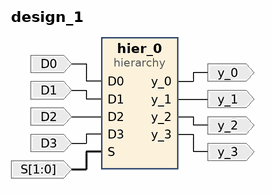
[diagram p0: block diagram of the top level]
# Vivado block design design_1, xc7z010clg400-1, Vivado 2023.2.2
create_bd_design design_1

create_bd_port -dir O y_0
create_bd_port -dir O y_1
create_bd_port -dir O y_2
create_bd_port -dir O y_3
create_bd_port -dir I -type data D0
create_bd_port -dir I D1
create_bd_port -dir I D2
create_bd_port -dir I D3
create_bd_port -dir I -from 1 -to 0 S

create_bd_cell -type hier hier_0

# ---- hierarchy /hier_0 ----
current_bd_instance /hier_0
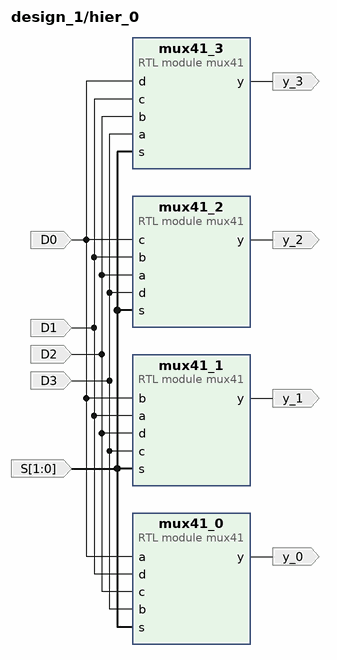
[diagram p1: block diagram inside /hier_0]
create_bd_pin -dir I -type data D0
create_bd_pin -dir I D3
create_bd_pin -dir I D2
create_bd_pin -dir I D1
create_bd_pin -dir I -from 1 -to 0 S
create_bd_pin -dir O y_0
create_bd_pin -dir O y_1
create_bd_pin -dir O y_2
create_bd_pin -dir O y_3

create_bd_cell -type module -reference mux41 mux41_0
create_bd_cell -type module -reference mux41 mux41_1
create_bd_cell -type module -reference mux41 mux41_2
create_bd_cell -type module -reference mux41 mux41_3

# ---- connections ----

current_bd_instance /hier_0
connect_bd_net -net D0_1 [get_bd_pins D0] [get_bd_pins mux41_3/d] [get_bd_pins mux41_1/b] [get_bd_pins mux41_2/c] [get_bd_pins mux41_0/a]
connect_bd_net -net D1_1 [get_bd_pins D1] [get_bd_pins mux41_3/c] [get_bd_pins mux41_2/b] [get_bd_pins mux41_1/a] [get_bd_pins mux41_0/d]
connect_bd_net -net D2_1 [get_bd_pins D2] [get_bd_pins mux41_3/b] [get_bd_pins mux41_2/a] [get_bd_pins mux41_1/d] [get_bd_pins mux41_0/c]
connect_bd_net -net D3_1 [get_bd_pins D3] [get_bd_pins mux41_3/a] [get_bd_pins mux41_1/c] [get_bd_pins mux41_2/d] [get_bd_pins mux41_0/b]
connect_bd_net [get_bd_pins S] [get_bd_pins mux41_3/s] [get_bd_pins mux41_2/s] [get_bd_pins mux41_1/s] [get_bd_pins mux41_0/s]
connect_bd_net [get_bd_pins mux41_0/y] [get_bd_pins y_0]
connect_bd_net [get_bd_pins mux41_1/y] [get_bd_pins y_1]
connect_bd_net [get_bd_pins mux41_2/y] [get_bd_pins y_2]
connect_bd_net [get_bd_pins mux41_3/y] [get_bd_pins y_3]

current_bd_instance /
connect_bd_net -net D0_1 [get_bd_ports D0] [get_bd_pins hier_0/D0]
connect_bd_net -net D1_1 [get_bd_ports D1] [get_bd_pins hier_0/D1]
connect_bd_net -net D2_1 [get_bd_ports D2] [get_bd_pins hier_0/D2]
connect_bd_net -net D3_1 [get_bd_ports D3] [get_bd_pins hier_0/D3]
connect_bd_net [get_bd_ports S] [get_bd_pins hier_0/S]
connect_bd_net -net mux41_0_y [get_bd_pins hier_0/y_0] [get_bd_ports y_0]
connect_bd_net -net mux41_1_y [get_bd_pins hier_0/y_1] [get_bd_ports y_1]
connect_bd_net -net mux41_2_y [get_bd_pins hier_0/y_2] [get_bd_ports y_2]
connect_bd_net -net mux41_3_y [get_bd_pins hier_0/y_3] [get_bd_ports y_3]

validate_bd_design
save_bd_design
